# EasyEDA Pro project 二版平衡车pcb.epro, schematic Schematic3
Create Date: 2024-08-15; Page Name: P1; Project Name: 平衡车; Schematic Name: Schematic3; Update Date: 2024-08-15; Company: 嘉立创EDA; Page Size: A4; Version: V1.0
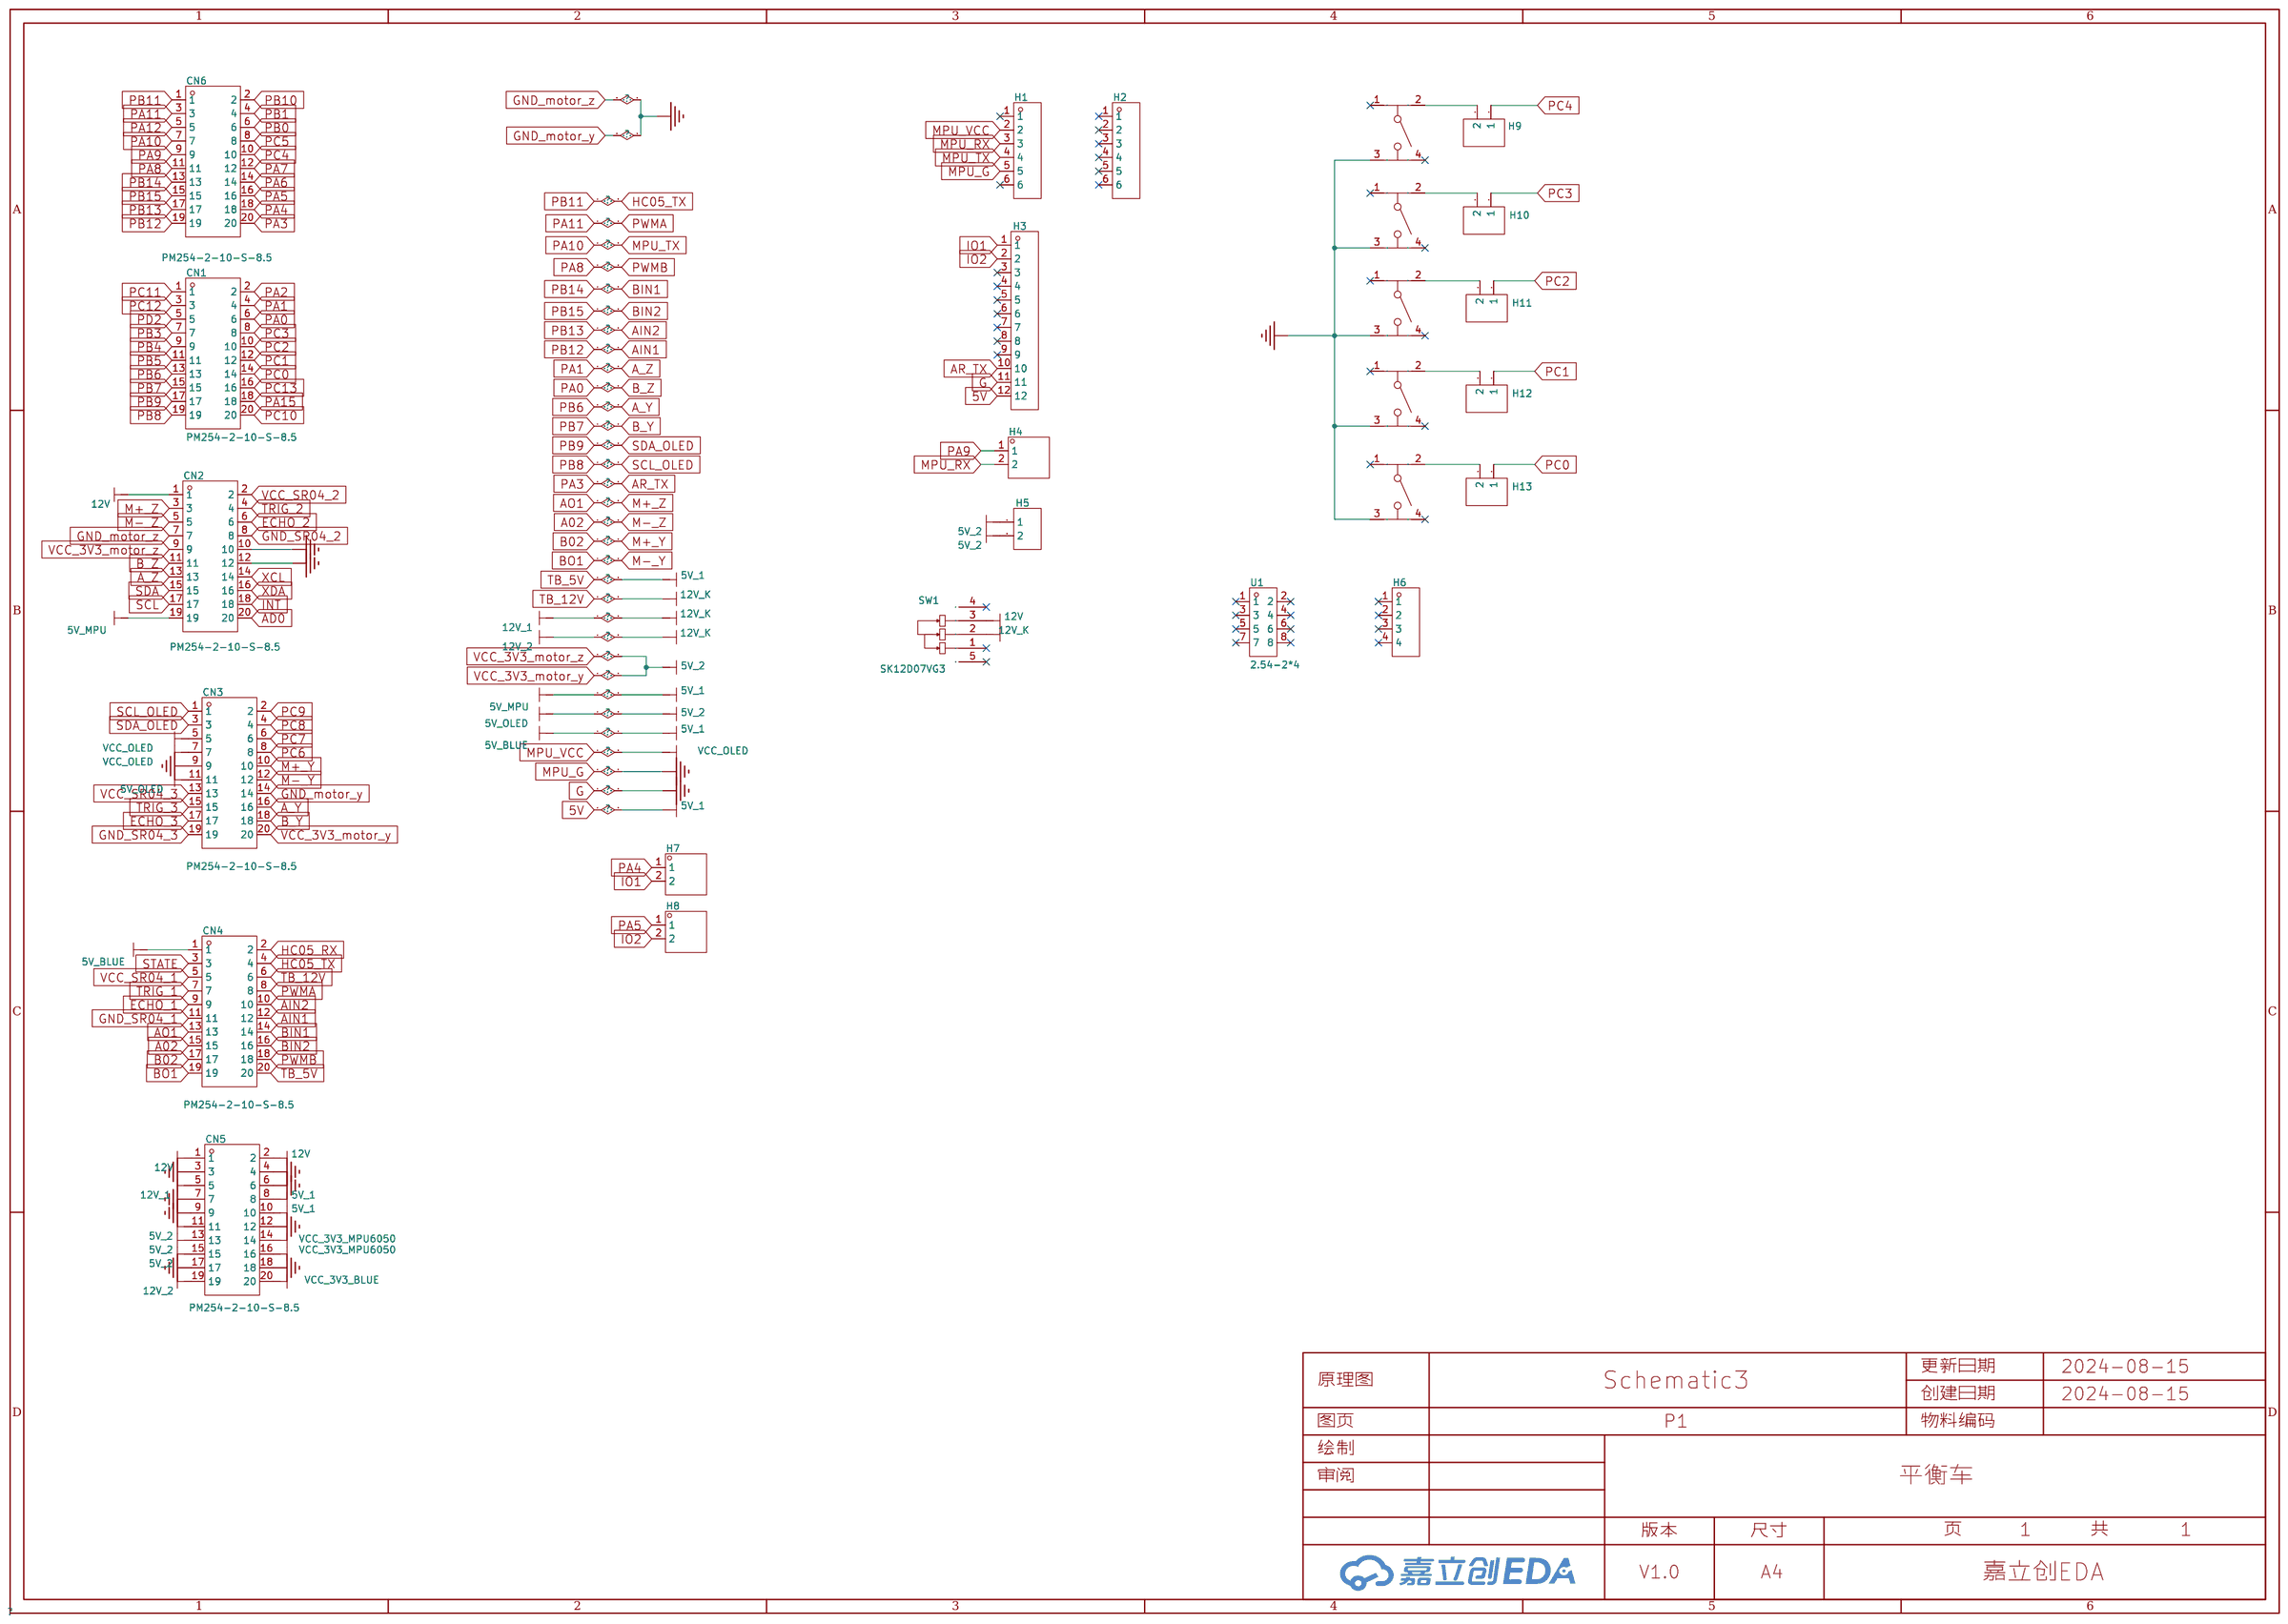
[diagram p2: schematic sheet]

## Parts
CN1  PM254-2-10-S-8.5  [HDR-SMD_20P-P2.54-V-F-R2-C10-S2.54-LS7.1]
CN2  PM254-2-10-S-8.5  [HDR-SMD_20P-P2.54-V-F-R2-C10-S2.54-LS7.1]
CN3  PM254-2-10-S-8.5  [HDR-SMD_20P-P2.54-V-F-R2-C10-S2.54-LS7.1]
CN4  PM254-2-10-S-8.5  [HDR-SMD_20P-P2.54-V-F-R2-C10-S2.54-LS7.1]
CN5  PM254-2-10-S-8.5  [HDR-SMD_20P-P2.54-V-F-R2-C10-S2.54-LS7.1]
CN6  PM254-2-10-S-8.5  [HDR-SMD_20P-P2.54-V-F-R2-C10-S2.54-LS7.1]
H1  -  [HDR-TH_6P-P2.54-V-F]
H2  -  [HDR-TH_6P-P2.54-V-F]
H3  -  [HDR-TH_12P-P2.54-V-F]
H4  -  [HDR-TH_2P-P2.54-V-M-1]
H5  -  [HDR-TH_2P-P2.54-V-F]
H6  -  [HDR-TH_4P-P2.54-V-F]
H7  -  [HDR-TH_2P-P2.54-V-M-1]
H8  -  [HDR-TH_2P-P2.54-V-M-1]
H9  -  [HDR-TH_2P-P2.54-V-F]
H10  -  [HDR-TH_2P-P2.54-V-F]
H11  -  [HDR-TH_2P-P2.54-V-F]
H12  -  [HDR-TH_2P-P2.54-V-F]
H13  -  [HDR-TH_2P-P2.54-V-F]
KEY1  AN6*6  [KEY-TH_4P-L6.0-W6.0-P6.50-LS4.5]
KEY2  AN6*6  [KEY-TH_4P-L6.0-W6.0-P6.50-LS4.5]
KEY3  AN6*6  [KEY-TH_4P-L6.0-W6.0-P6.50-LS4.5]
KEY4  AN6*6  [KEY-TH_4P-L6.0-W6.0-P6.50-LS4.5]
KEY5  AN6*6  [KEY-TH_4P-L6.0-W6.0-P6.50-LS4.5]
SW1  SK12D07VG3  [SW-TH_SK12D07VG3]
U1  2.54-2*4  [HDR-TH_8P-P2.54-V-F-R2-C4-S2.54]

## Library data of the parts
CN1-CN6 = PM254-2-10-S-8.5: 插孔结构:2x10P;间距:2.54mm;行距:2.54mm;圆孔/方孔:方孔;安装类型:立贴;排数:双排;总孔位数:20P;额定电流:3A;插孔方向:顶部;塑高:8.5mm;触头材质:铜合金;工作温度范围:-40℃~+105℃;焊接温度(最大值):260℃@5S;; LCSC Part Name: 2x10P 间距:2.54mm 立贴; Supplier Part: C3975155; Manufacturer: HCTL(华灿天禄); Supplier Footprint: SMD,P=2.54mm; JLCPCB Part Class: 扩展库; Datasheet: https://atta.szlcsc.com/upload/public/pdf/source/20230609/7C6F8D8E301C6BBC8F19D55951C36597.pdf; Supplier: LCSC; Holes Structure: 2x10P; Pitch: 2.54mm; Row Spacing: 2.54mm; Circular Hole / Square Hole: 方孔; Mounting Type: 立贴; Number of Rows: 双排; Number of Holes: 20P; Current Rating (Max): 3A; Holes Direction: 顶部; Insulation Height: 8.5mm; Contact Material: 铜合金; Operating Temperature Range: -40℃~+105℃; Soldering Temperature(Max): 260℃@5S
H1 H2 = HDR-F_2.54_1x6P: Supplier Part: C40877; Supplier Footprint: 插件
H3 = HDR-F_2.54_1x12P: Supplier Part: C2905419; Supplier Footprint: 插件
H4 H7 H8 = HDR-M_2.54_1x2P: Supplier Part: C124375; Supplier Footprint: 插件
H5 H9-H13 = HDR-F_2.54_1x2P: Supplier Part: C49661; Supplier Footprint: 插件
H6 = HDR-F_2.54_1x4P: Supplier Part: C2718488; Supplier Footprint: 插件
KEY1-KEY5 = AN6*6: Supplier Part: C9900018275; Supplier Footprint: KEY-TH_4P-L6.0-W6.0-P4.50-LS6.50; JLCPCB Part Class: 扩展库; Supplier: LCSC
SW1 = SK12D07VG3: 电路结构:单刀双掷;安装方式:侧插;开关颜色:-;额定电流(DC):500mA;额定电压(DC):50V;额定电流(AC):-;额定电压(AC):-;机械寿命:5千次;; LCSC Part Name: 两档位卧式拨动开关,柄长3MM; Supplier Part: C431547; Manufacturer: SHOU HAN(首韩); Supplier Footprint: 插件; JLCPCB Part Class: 扩展库; Datasheet: https://atta.szlcsc.com/upload/public/pdf/source/20190925/C431547_01B93C6F3FA5C09E15F8CCBF4E6DB91A.pdf; Supplier: LCSC; Circuit: 单刀双掷; Pin Style: PC引脚; Switch Length: 8.7mm; Switch Width: 4.4mm; Switch Height: 4.7mm; Mounting Style: 侧插; Current Rating (DC): 500mA; Voltage Rating (DC): 50V; Mechanical Life: 5千次; Operating Temperature: -10℃~+50℃
U1 = 2.54-2*4: 插孔结构:2x4P;间距:2.54mm;行距:2.54mm;圆孔/方孔:方孔;安装类型:直插;排数:双排;总孔位数:8P;额定电流:2.5A;额定电压:-;插孔方向:顶部;塑高:8.5mm;工作温度范围:-40℃~+105℃;; LCSC Part Name: 间距:2.54mm 2x4P 直插; Supplier Part: C2977588; Manufacturer: ZHOURI(洲日); Supplier Footprint: 插件,P=2.54mm; JLCPCB Part Class: 扩展库; Datasheet: https://atta.szlcsc.com/upload/public/pdf/source/20220328/363EB391BC0EB759CF231FC910753CBE.pdf; Supplier: LCSC; Holes Structure: 2x4P; Pitch: 2.54mm; Row Spacing: 2.54mm; Circular Hole / Square Hole: 方孔; Mounting Type: 直插; Number of Rows: 双排; Number of Holes: 8P; Current Rating (Max): 2.5A; Holes Direction: 顶部; Insulation Height: 8.5mm; Operating Temperature Range: -40℃~+105℃

## Nets
5V_1: CN2.19 CN4.1 CN4.20 CN5.8 CN5.10 H3.12
5V_2: CN2.9 CN3.11 CN3.20 CN5.11 CN5.13 CN5.15 H5.1 H5.2
12V: CN2.1 CN5.1 CN5.2 SW1.3
12V_1: CN4.6 CN5.5 CN5.19 SW1.2
GND: CN2.7 CN2.10 CN2.12 CN3.9 CN3.14 CN5.3 CN5.4 CN5.6 CN5.7 CN5.9 CN5.12 CN5.17 CN5.18 H1.5 H3.11 KEY1.3 KEY2.3 KEY3.3 KEY4.3 KEY5.3
GND_SR04_1: CN4.11
GND_SR04_2: CN2.8
GND_SR04_3: CN3.19
VCC_3V3_BLUE: CN5.20
VCC_3V3_MPU6050: CN5.14 CN5.16
VCC_OLED: CN3.5 CN3.7 H1.2
VCC_SR04_1: CN4.5
VCC_SR04_2: CN2.2
VCC_SR04_3: CN3.13
A02: CN2.5 CN4.15
A_Y: CN1.13 CN3.16
A_Z: CN1.4 CN2.13
AD0: CN2.20
AIN1: CN4.12 CN6.19
AIN2: CN4.10 CN6.17
AO1: CN2.3 CN4.13
AR_TX: CN6.20 H3.10
B02: CN3.10 CN4.17
B_Y: CN1.15 CN3.18
B_Z: CN1.6 CN2.11
BIN1: CN4.14 CN6.13
BIN2: CN4.16 CN6.15
BO1: CN3.12 CN4.19
ECHO_1: CN4.9
ECHO_2: CN2.6
ECHO_3: CN3.17
HC05_RX: CN4.2
HC05_TX: CN4.4 CN6.1
INT: CN2.18
IO1: H3.1 H7.2
IO2: H3.2 H8.2
MPU_RX: H1.3 H4.2
MPU_TX: CN6.7 H1.4
PA2: CN1.2
PA4: CN6.18 H7.1
PA5: CN6.16 H8.1
PA6: CN6.14
PA7: CN6.12
PA8: CN4.18 CN6.11
PA9: CN6.9 H4.1
PA11: CN4.8 CN6.3
PA12: CN6.5
PA15: CN1.18
PB0: CN6.6
PB1: CN6.4
PB3: CN1.7
PB4: CN1.9
PB5: CN1.11
PB8: CN1.19 CN3.1
PB9: CN1.17 CN3.3
PB10: CN6.2
PC0: CN1.14 H13.1
PC1: CN1.12 H12.1
PC2: CN1.10 H11.1
PC3: CN1.8 H10.1
PC4: CN6.10 H9.1
PC5: CN6.8
PC6: CN3.8
PC7: CN3.6
PC8: CN3.4
PC9: CN3.2
PC10: CN1.20
PC11: CN1.1
PC12: CN1.3
PC13: CN1.16
PD2: CN1.5
SCL: CN2.17
SDA: CN2.15
STATE: CN4.3
TRIG_1: CN4.7
TRIG_2: CN2.4
TRIG_3: CN3.15
XCL: CN2.14
XDA: CN2.16
$1N18039: H9.2 KEY1.2
$1N18041: H10.2 KEY2.2
$1N18043: H11.2 KEY3.2
$1N18045: H12.2 KEY4.2
$1N18047: H13.2 KEY5.2

Not connected (* = marked no-connect by the designer): H1 1* 6*; H2 1* 2* 3* 4* 5* 6*; H3 3* 4* 5* 6* 7* 8* 9*; H6 1* 2* 3* 4*; KEY1 1* 4*; KEY2 1* 4*; KEY3 1* 4*; KEY4 1* 4*; KEY5 1* 4*; SW1 1* 4* 5*; U1 1* 2* 3* 4* 5* 6* 7* 8*
